# Altium schematic sheet Swith_Matrix.SchDoc
size A4; SheetNumber: 3; SheetTotal: 5
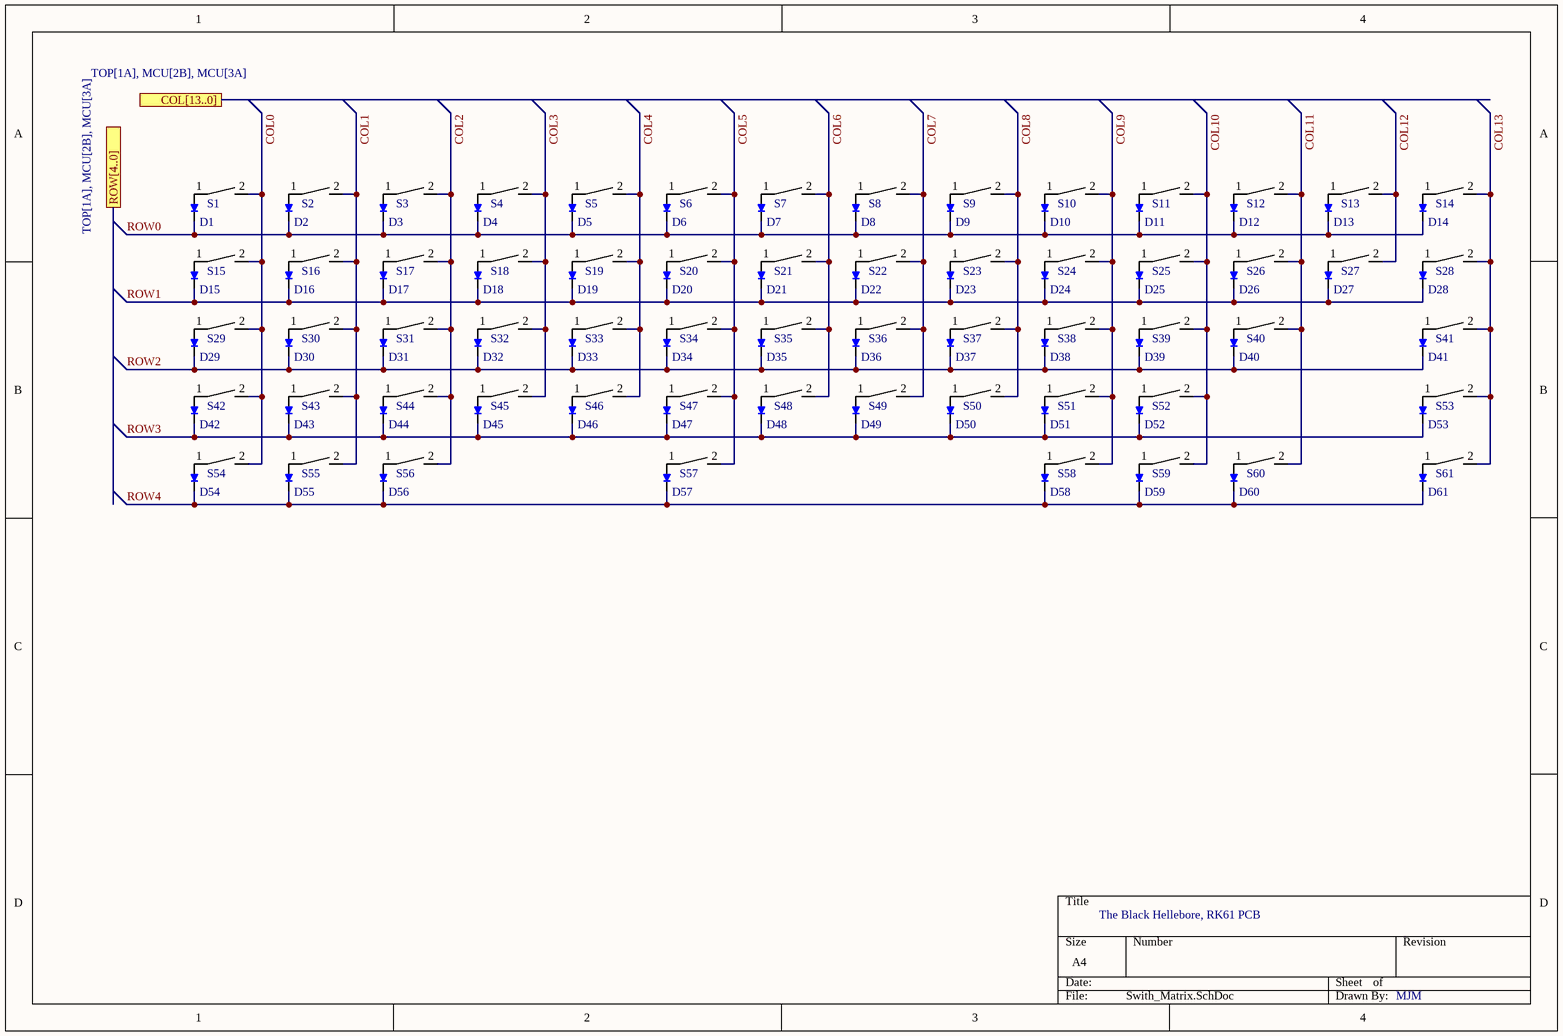
[diagram p0: Swith_Matrix.SchDoc]

## Parts
D1  RB520S30T5G  [ONSC-SOD-523-2-502-01_V]  (value not drawn)
D2  RB520S30T5G  [ONSC-SOD-523-2-502-01_V]  (value not drawn)
D3  RB520S30T5G  [ONSC-SOD-523-2-502-01_V]  (value not drawn)
D4  RB520S30T5G  [ONSC-SOD-523-2-502-01_V]  (value not drawn)
D5  RB520S30T5G  [ONSC-SOD-523-2-502-01_V]  (value not drawn)
D6  RB520S30T5G  [ONSC-SOD-523-2-502-01_V]  (value not drawn)
D7  RB520S30T5G  [ONSC-SOD-523-2-502-01_V]  (value not drawn)
D8  RB520S30T5G  [ONSC-SOD-523-2-502-01_V]  (value not drawn)
D9  RB520S30T5G  [ONSC-SOD-523-2-502-01_V]  (value not drawn)
D10  RB520S30T5G  [ONSC-SOD-523-2-502-01_V]  (value not drawn)
D11  RB520S30T5G  [ONSC-SOD-523-2-502-01_V]  (value not drawn)
D12  RB520S30T5G  [ONSC-SOD-523-2-502-01_V]  (value not drawn)
D13  RB520S30T5G  [ONSC-SOD-523-2-502-01_V]  (value not drawn)
D14  RB520S30T5G  [ONSC-SOD-523-2-502-01_V]  (value not drawn)
D15  RB520S30T5G  [ONSC-SOD-523-2-502-01_V]  (value not drawn)
D16  RB520S30T5G  [ONSC-SOD-523-2-502-01_V]  (value not drawn)
D17  RB520S30T5G  [ONSC-SOD-523-2-502-01_V]  (value not drawn)
D18  RB520S30T5G  [ONSC-SOD-523-2-502-01_V]  (value not drawn)
D19  RB520S30T5G  [ONSC-SOD-523-2-502-01_V]  (value not drawn)
D20  RB520S30T5G  [ONSC-SOD-523-2-502-01_V]  (value not drawn)
D21  RB520S30T5G  [ONSC-SOD-523-2-502-01_V]  (value not drawn)
D22  RB520S30T5G  [ONSC-SOD-523-2-502-01_V]  (value not drawn)
D23  RB520S30T5G  [ONSC-SOD-523-2-502-01_V]  (value not drawn)
D24  RB520S30T5G  [ONSC-SOD-523-2-502-01_V]  (value not drawn)
D25  RB520S30T5G  [ONSC-SOD-523-2-502-01_V]  (value not drawn)
D26  RB520S30T5G  [ONSC-SOD-523-2-502-01_V]  (value not drawn)
D27  RB520S30T5G  [ONSC-SOD-523-2-502-01_V]  (value not drawn)
D28  RB520S30T5G  [ONSC-SOD-523-2-502-01_V]  (value not drawn)
D29  RB520S30T5G  [ONSC-SOD-523-2-502-01_V]  (value not drawn)
D30  RB520S30T5G  [ONSC-SOD-523-2-502-01_V]  (value not drawn)
D31  RB520S30T5G  [ONSC-SOD-523-2-502-01_V]  (value not drawn)
D32  RB520S30T5G  [ONSC-SOD-523-2-502-01_V]  (value not drawn)
D33  RB520S30T5G  [ONSC-SOD-523-2-502-01_V]  (value not drawn)
D34  RB520S30T5G  [ONSC-SOD-523-2-502-01_V]  (value not drawn)
D35  RB520S30T5G  [ONSC-SOD-523-2-502-01_V]  (value not drawn)
D36  RB520S30T5G  [ONSC-SOD-523-2-502-01_V]  (value not drawn)
D37  RB520S30T5G  [ONSC-SOD-523-2-502-01_V]  (value not drawn)
D38  RB520S30T5G  [ONSC-SOD-523-2-502-01_V]  (value not drawn)
D39  RB520S30T5G  [ONSC-SOD-523-2-502-01_V]  (value not drawn)
D40  RB520S30T5G  [ONSC-SOD-523-2-502-01_V]  (value not drawn)
D41  RB520S30T5G  [ONSC-SOD-523-2-502-01_V]  (value not drawn)
D42  RB520S30T5G  [ONSC-SOD-523-2-502-01_V]  (value not drawn)
D43  RB520S30T5G  [ONSC-SOD-523-2-502-01_V]  (value not drawn)
D44  RB520S30T5G  [ONSC-SOD-523-2-502-01_V]  (value not drawn)
D45  RB520S30T5G  [ONSC-SOD-523-2-502-01_V]  (value not drawn)
D46  RB520S30T5G  [ONSC-SOD-523-2-502-01_V]  (value not drawn)
D47  RB520S30T5G  [ONSC-SOD-523-2-502-01_V]  (value not drawn)
D48  RB520S30T5G  [ONSC-SOD-523-2-502-01_V]  (value not drawn)
D49  RB520S30T5G  [ONSC-SOD-523-2-502-01_V]  (value not drawn)
D50  RB520S30T5G  [ONSC-SOD-523-2-502-01_V]  (value not drawn)
D51  RB520S30T5G  [ONSC-SOD-523-2-502-01_V]  (value not drawn)
D52  RB520S30T5G  [ONSC-SOD-523-2-502-01_V]  (value not drawn)
D53  RB520S30T5G  [ONSC-SOD-523-2-502-01_V]  (value not drawn)
D54  RB520S30T5G  [ONSC-SOD-523-2-502-01_V]  (value not drawn)
D55  RB520S30T5G  [ONSC-SOD-523-2-502-01_V]  (value not drawn)
D56  RB520S30T5G  [ONSC-SOD-523-2-502-01_V]  (value not drawn)
D57  RB520S30T5G  [ONSC-SOD-523-2-502-01_V]  (value not drawn)
D58  RB520S30T5G  [ONSC-SOD-523-2-502-01_V]  (value not drawn)
D59  RB520S30T5G  [ONSC-SOD-523-2-502-01_V]  (value not drawn)
D60  RB520S30T5G  [ONSC-SOD-523-2-502-01_V]  (value not drawn)
D61  RB520S30T5G  [ONSC-SOD-523-2-502-01_V]  (value not drawn)
S1  1U-5Pin  [SW_PG151101S11]  (value not drawn)
S2  1U-5Pin  [SW_PG151101S11]  (value not drawn)
S3  1U-5Pin  [SW_PG151101S11]  (value not drawn)
S4  1U-5Pin  [SW_PG151101S11]  (value not drawn)
S5  1U-5Pin  [SW_PG151101S11]  (value not drawn)
S6  1U-5Pin  [SW_PG151101S11]  (value not drawn)
S7  1U-5Pin  [SW_PG151101S11]  (value not drawn)
S8  1U-5Pin  [SW_PG151101S11]  (value not drawn)
S9  1U-5Pin  [SW_PG151101S11]  (value not drawn)
S10  1U-5Pin  [SW_PG151101S11]  (value not drawn)
S11  1U-5Pin  [SW_PG151101S11]  (value not drawn)
S12  1U-5Pin  [SW_PG151101S11]  (value not drawn)
S13  1U-5Pin  [SW_PG151101S11]  (value not drawn)
S14  1U-5Pin  [SW_PG151101S11]  (value not drawn)
S15  1U-5Pin  [SW_PG151101S11]  (value not drawn)
S16  1U-5Pin  [SW_PG151101S11]  (value not drawn)
S17  1U-5Pin  [SW_PG151101S11]  (value not drawn)
S18  1U-5Pin  [SW_PG151101S11]  (value not drawn)
S19  1U-5Pin  [SW_PG151101S11]  (value not drawn)
S20  1U-5Pin  [SW_PG151101S11]  (value not drawn)
S21  1U-5Pin  [SW_PG151101S11]  (value not drawn)
S22  1U-5Pin  [SW_PG151101S11]  (value not drawn)
S23  1U-5Pin  [SW_PG151101S11]  (value not drawn)
S24  1U-5Pin  [SW_PG151101S11]  (value not drawn)
S25  1U-5Pin  [SW_PG151101S11]  (value not drawn)
S26  1U-5Pin  [SW_PG151101S11]  (value not drawn)
S27  1U-5Pin  [SW_PG151101S11]  (value not drawn)
S28  1U-5Pin  [SW_PG151101S11]  (value not drawn)
S29  1U-5Pin  [SW_PG151101S11]  (value not drawn)
S30  1U-5Pin  [SW_PG151101S11]  (value not drawn)
S31  1U-5Pin  [SW_PG151101S11]  (value not drawn)
S32  1U-5Pin  [SW_PG151101S11]  (value not drawn)
S33  1U-5Pin  [SW_PG151101S11]  (value not drawn)
S34  1U-5Pin  [SW_PG151101S11]  (value not drawn)
S35  1U-5Pin  [SW_PG151101S11]  (value not drawn)
S36  1U-5Pin  [SW_PG151101S11]  (value not drawn)
S37  1U-5Pin  [SW_PG151101S11]  (value not drawn)
S38  1U-5Pin  [SW_PG151101S11]  (value not drawn)
S39  1U-5Pin  [SW_PG151101S11]  (value not drawn)
S40  1U-5Pin  [SW_PG151101S11]  (value not drawn)
S41  1U-5Pin  [SW_PG151101S11]  (value not drawn)
S42  1U-5Pin  [SW_PG151101S11]  (value not drawn)
S43  1U-5Pin  [SW_PG151101S11]  (value not drawn)
S44  1U-5Pin  [SW_PG151101S11]  (value not drawn)
S45  1U-5Pin  [SW_PG151101S11]  (value not drawn)
S46  1U-5Pin  [SW_PG151101S11]  (value not drawn)
S47  1U-5Pin  [SW_PG151101S11]  (value not drawn)
S48  1U-5Pin  [SW_PG151101S11]  (value not drawn)
S49  1U-5Pin  [SW_PG151101S11]  (value not drawn)
S50  1U-5Pin  [SW_PG151101S11]  (value not drawn)
S51  1U-5Pin  [SW_PG151101S11]  (value not drawn)
S52  1U-5Pin  [SW_PG151101S11]  (value not drawn)
S53  1U-5Pin  [SW_PG151101S11]  (value not drawn)
S54  1U-5Pin  [SW_PG151101S11]  (value not drawn)
S55  1U-5Pin  [SW_PG151101S11]  (value not drawn)
S56  1U-5Pin  [SW_PG151101S11]  (value not drawn)
S57  1U-5Pin  [SW_PG151101S11]  (value not drawn)
S58  1U-5Pin  [SW_PG151101S11]  (value not drawn)
S59  1U-5Pin  [SW_PG151101S11]  (value not drawn)
S60  1U-5Pin  [SW_PG151101S11]  (value not drawn)
S61  1U-5Pin  [SW_PG151101S11]  (value not drawn)

## Ports
COL[13..0] (see TOP[1A], MCU[2B], MCU[3A]), ROW[4..0] (see TOP[1A], MCU[2B], MCU[3A])

## Nets
COL0: S1.2 S15.2 S29.2 S42.2 S54.2
COL1: S2.2 S16.2 S30.2 S43.2 S55.2
COL2: S3.2 S17.2 S31.2 S44.2 S56.2
COL3: S4.2 S18.2 S32.2 S45.2
COL4: S5.2 S19.2 S33.2 S46.2
COL5: S6.2 S20.2 S34.2 S47.2 S57.2
COL6: S7.2 S21.2 S35.2 S48.2
COL7: S8.2 S22.2 S36.2 S49.2
COL8: S9.2 S23.2 S37.2 S50.2
COL9: S10.2 S24.2 S38.2 S51.2 S58.2
COL10: S11.2 S25.2 S39.2 S52.2 S59.2
COL11: S12.2 S26.2 S40.2 S60.2
COL12: S13.2 S27.2
COL13: S14.2 S28.2 S41.2 S53.2 S61.2
ROW0: D1.1(K) D2.1(K) D3.1(K) D4.1(K) D5.1(K) D6.1(K) D7.1(K) D8.1(K) D9.1(K) D10.1(K) D11.1(K) D12.1(K) D13.1(K) D14.1(K)
ROW1: D15.1(K) D16.1(K) D17.1(K) D18.1(K) D19.1(K) D20.1(K) D21.1(K) D22.1(K) D23.1(K) D24.1(K) D25.1(K) D26.1(K) D27.1(K) D28.1(K)
ROW2: D29.1(K) D30.1(K) D31.1(K) D32.1(K) D33.1(K) D34.1(K) D35.1(K) D36.1(K) D37.1(K) D38.1(K) D39.1(K) D40.1(K) D41.1(K)
ROW3: D42.1(K) D43.1(K) D44.1(K) D45.1(K) D46.1(K) D47.1(K) D48.1(K) D49.1(K) D50.1(K) D51.1(K) D52.1(K) D53.1(K)
ROW4: D54.1(K) D55.1(K) D56.1(K) D57.1(K) D58.1(K) D59.1(K) D60.1(K) D61.1(K)
NetD1_2: D1.2(A) S1.1
NetD2_2: D2.2(A) S2.1
NetD3_2: D3.2(A) S3.1
NetD4_2: D4.2(A) S4.1
NetD5_2: D5.2(A) S5.1
NetD6_2: D6.2(A) S6.1
NetD7_2: D7.2(A) S7.1
NetD8_2: D8.2(A) S8.1
NetD9_2: D9.2(A) S9.1
NetD10_2: D10.2(A) S10.1
NetD11_2: D11.2(A) S11.1
NetD12_2: D12.2(A) S12.1
NetD13_2: D13.2(A) S13.1
NetD14_2: D14.2(A) S14.1
NetD15_2: D15.2(A) S15.1
NetD16_2: D16.2(A) S16.1
NetD17_2: D17.2(A) S17.1
NetD18_2: D18.2(A) S18.1
NetD19_2: D19.2(A) S19.1
NetD20_2: D20.2(A) S20.1
NetD21_2: D21.2(A) S21.1
NetD22_2: D22.2(A) S22.1
NetD23_2: D23.2(A) S23.1
NetD24_2: D24.2(A) S24.1
NetD25_2: D25.2(A) S25.1
NetD26_2: D26.2(A) S26.1
NetD27_2: D27.2(A) S27.1
NetD28_2: D28.2(A) S28.1
NetD29_2: D29.2(A) S29.1
NetD30_2: D30.2(A) S30.1
NetD31_2: D31.2(A) S31.1
NetD32_2: D32.2(A) S32.1
NetD33_2: D33.2(A) S33.1
NetD34_2: D34.2(A) S34.1
NetD35_2: D35.2(A) S35.1
NetD36_2: D36.2(A) S36.1
NetD37_2: D37.2(A) S37.1
NetD38_2: D38.2(A) S38.1
NetD39_2: D39.2(A) S39.1
NetD40_2: D40.2(A) S40.1
NetD41_2: D41.2(A) S41.1
NetD42_2: D42.2(A) S42.1
NetD43_2: D43.2(A) S43.1
NetD44_2: D44.2(A) S44.1
NetD45_2: D45.2(A) S45.1
NetD46_2: D46.2(A) S46.1
NetD47_2: D47.2(A) S47.1
NetD48_2: D48.2(A) S48.1
NetD49_2: D49.2(A) S49.1
NetD50_2: D50.2(A) S50.1
NetD51_2: D51.2(A) S51.1
NetD52_2: D52.2(A) S52.1
NetD53_2: D53.2(A) S53.1
NetD54_2: D54.2(A) S54.1
NetD55_2: D55.2(A) S55.1
NetD56_2: D56.2(A) S56.1
NetD57_2: D57.2(A) S57.1
NetD58_2: D58.2(A) S58.1
NetD59_2: D59.2(A) S59.1
NetD60_2: D60.2(A) S60.1
NetD61_2: D61.2(A) S61.1

## Notes on the sheet
- The Black Hellebore, RK61 PCB
- MJM

## Library data of the parts
D1-D61 = CMP-070-000008-4: RB520S30T5G - 30 V 200 mA Surface Mount Schottky Diode - SOD-523
S1-S61 = CMP-094-000005-7: Keyswitch 1U Cherry MX, 5Pin, CPG151101S11-16; MF: Kailh; Pin Count: 5; MP: CPG151101S11-16; Design Item ID: CPG151101S11-16; supplier part number: CPG151101S11-16